# Altium schematic sheet GPS.SchDoc
size A
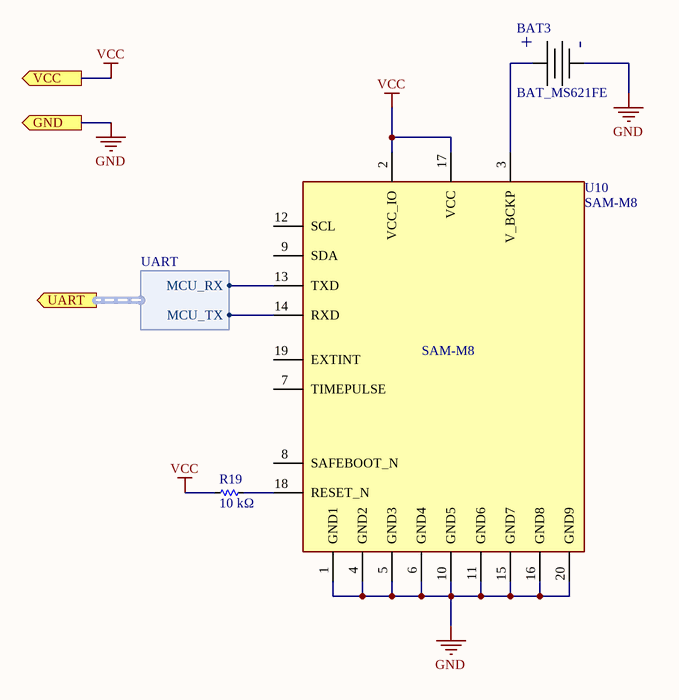
[diagram p0: GPS.SchDoc]

## Parts
BAT3  BAT_MS621FE  [BATT_COINCELL_RECHARGEABLE]
R19  Resistance: 10 kΩ  [R0603]  (hidden comment: 311-10.0KHRCT-ND)
U10  SAM-M8  [SAM-M8]

## Ports
GND (out), UART (out, harness UART), VCC (out)

## Harnesses
UART: MCU_RX, MCU_TX

## Nets
GND: BAT3.- U10.1(GND1) U10.4(GND2) U10.5(GND3) U10.6(GND4) U10.10(GND5) U10.11(GND6) U10.15(GND7) U10.16(GND8) U10.20(GND9) ; port GND
VCC: R19.1 U10.2(VCC_IO) U10.17(VCC) ; port VCC
NetBAT3_+: BAT3.+ U10.3(V_BCKP)
NetR19_2: R19.2 U10.18(RESET_N)
NetU10_13: U10.13(TXD) ; port UART.MCU_RX
NetU10_14: U10.14(RXD) ; port UART.MCU_TX

Not connected (* = marked no-connect by the designer): U10 7(TIMEPULSE) 8(SAFEBOOT_N) 9(SDA) 12(SCL) 19(EXTINT)

## Library data of the parts
BAT3 = CMP-060-0000-1: MS621FE RECHARGEABLE COIN CELL BACKUP; Manufacturer: Seiko Instruments; Manufacturer Part Number: MS621FE-FL11E; Battery Chemistry: Lithium; Battery Cell Size: Coin, 6.8mm; Capacity: 5.5mAh; Discharge Rate: 15µA; Shipping Info: Due to restrictions, only ground shipment is allowed.; RoHS: RoHS Compliant; Stock 1: 41059; Pricing 1: 1=2.04, 10=1.838, 50=1.6338, 100=1.4296, 250=1.30704, 500=1.22534, 1000=1.09051, 2500=1.0112, 5000=0.99138 (USD); Part Status: Active; Size / Dimension: 0.27" Dia x 0.08" H (6.8mm x 2.1mm); Termination Style: SMD (SMT) Tab; Standard Charge Current: 15µA; Standard Charge Time: -; Weight: 0.23g; ComponentLink1URL: http://www.sii.co.jp/en/me/files/2017/04/MicroBatteryCatalogue-E_2017_web.pdf; ComponentLink1Description: http://www.sii.co.jp/en/me/files/2017/04/MicroBatteryCatalogue-E_2017_web.pdf; Design Item ID: BAT_MS621FE; Source: miscellaneous.SchLib
R19 = CMP-126-0273-1: RES SMD 10K OHM 1% 1/10W 0603; Manufacturer Part Number: RC0603FR-0710KL; Manufacturer: Yageo; Resistance (Sortable): 10000; Power (Watts): 0.1W, 1/10W; Temperature Coefficient: ±100ppm/°C; Datasheets: http://www.yageo.com/documents/recent/PYu-RC_Group_51_RoHS_L_9.pdf; Image: //media.digikey.com/Renders/Yageo%20Renders/0603-(1608-Metric).jpg; Tolerance: ±1%; Operating Temperature: -55°C ~ 155°C
U10 = SAM-M8: ublox SAM GNSS antenna module; Manufacturer: u-blox; Part Description: u-blox SAM GNSS antenna module; Value: SAM-M8